# EAGLE design radio-86rk-SRAM-sdcard (EAGLE 7.1.0)
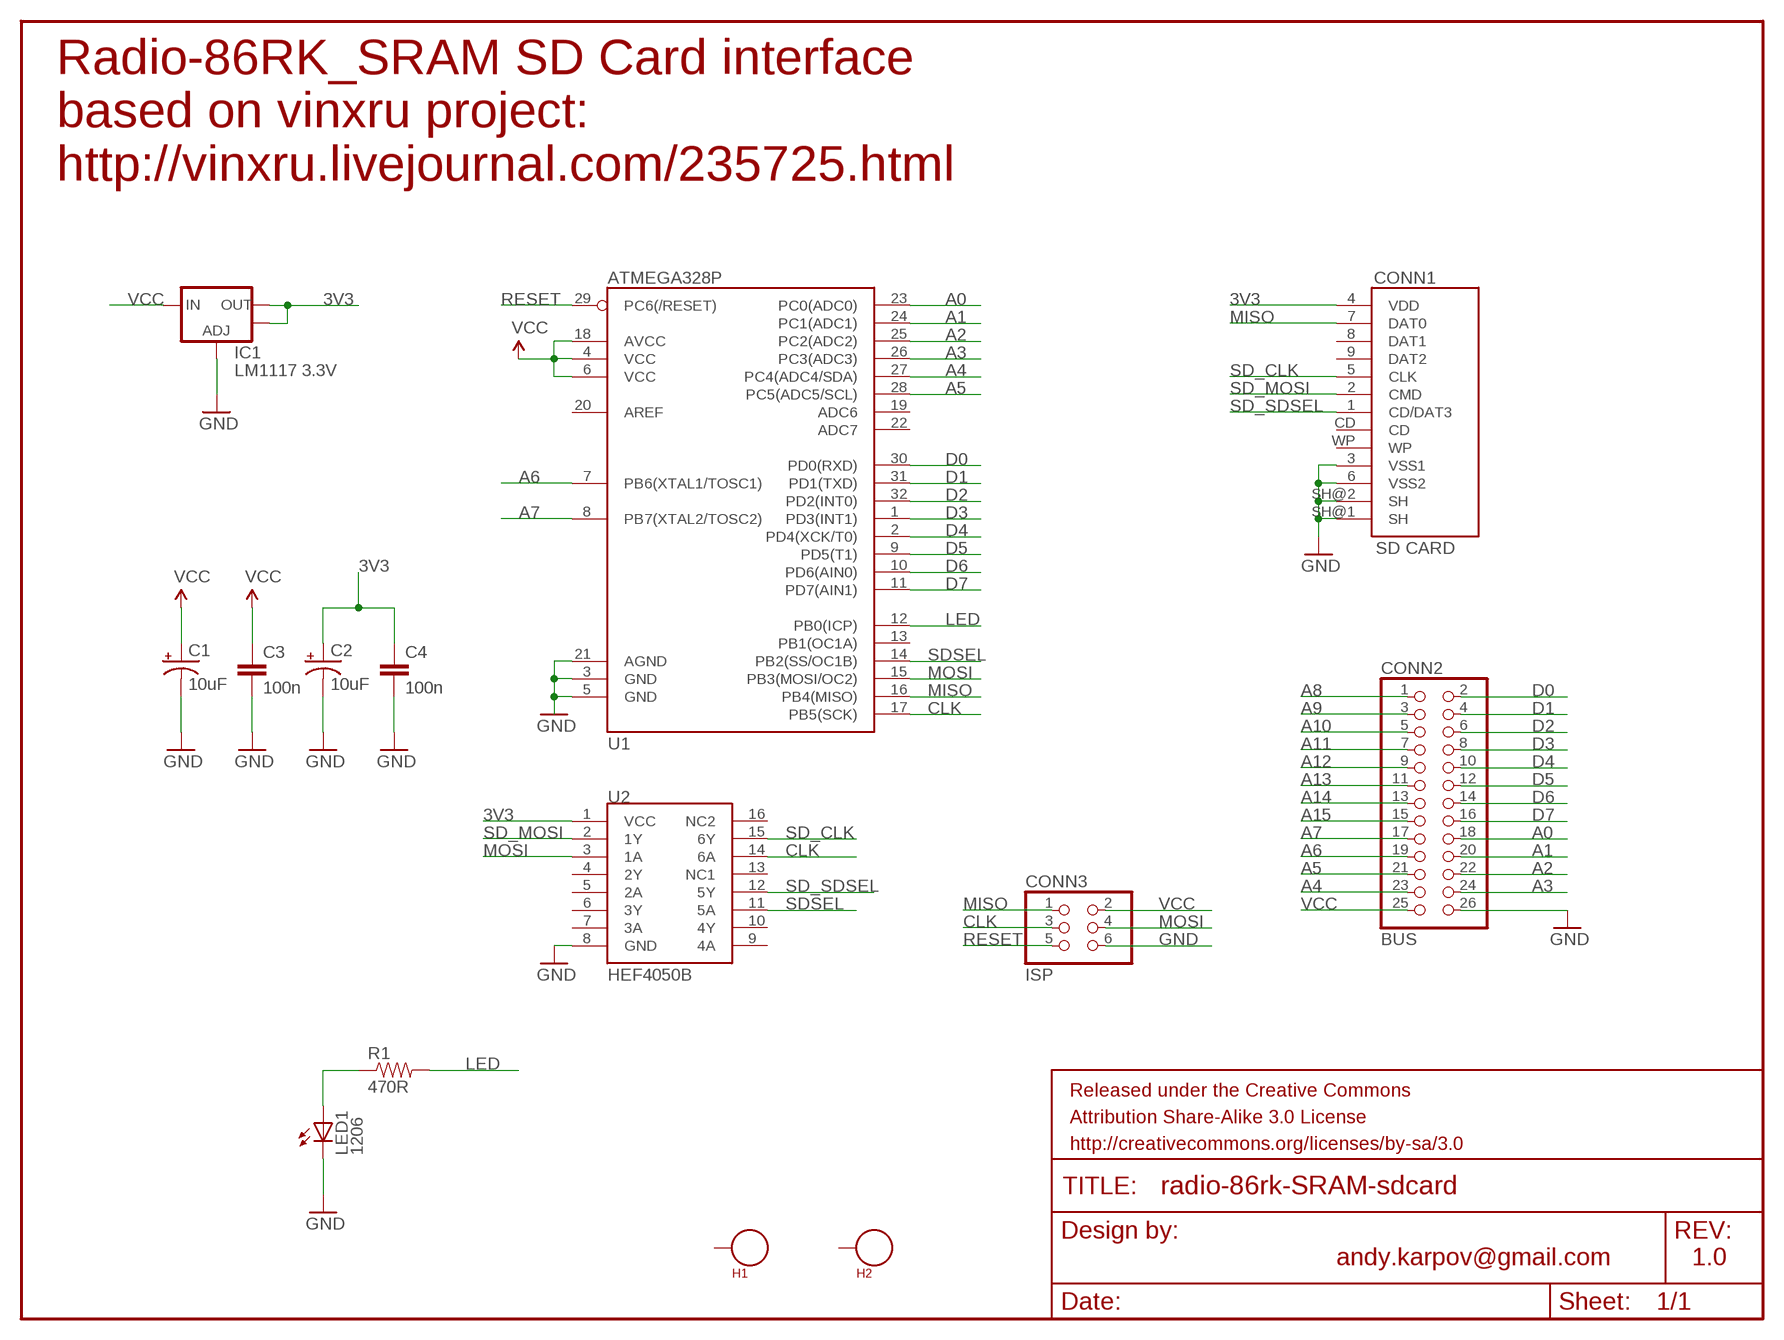
[diagram p0: schematic, sheet 1]

## Parts
C1  10uF  10UF-16V-10%(TANT)  [EIA3216]
C2  10uF  10UF-16V-10%(TANT)  [EIA3216]
C3  100n  CAP1206  [1206]
C4  100n  CAP1206  [1206]
CONN1  SD CARD  SD_CARD_SOCKET4UCON  [SDCARD_4UCONN]
CONN2  BUS  PINHD-2X13  [2X13]
CONN3  ISP  PINHD-2X3  [2X03]
FRAME1  FRAME-LETTER  [CREATIVE_COMMONS]
H1  SEW_HOLE  [SIMPLE_HOLE]
H2  SEW_HOLE  [SIMPLE_HOLE]
IC1  LM1117 3.3V  V_REG_LM1117SOT223  [SOT223]
LED1  1206  LEDCHIPLED_1206  [CHIPLED_1206]
R1  470R  RESISTOR1206  [1206]
U1  ATMEGA328P  ATMEGA328_SMT  [TQFP32-08]
U2  HEF4050B  HEF4050BSO16  [SO16]

## Nets
3V3: C2.A(+) C4.1 CONN1.4(VDD) IC1.2(OUT) IC1.4(OUT) U2.1(VCC)
A0: CONN2.18 U1.23(PC0(ADC0))
A1: CONN2.20 U1.24(PC1(ADC1))
A2: CONN2.22 U1.25(PC2(ADC2))
A3: CONN2.24 U1.26(PC3(ADC3))
A4: CONN2.23 U1.27(PC4(ADC4/SDA))
A5: CONN2.21 U1.28(PC5(ADC5/SCL))
A6: CONN2.19 U1.7(PB6(XTAL1/TOSC1))
A7: CONN2.17 U1.8(PB7(XTAL2/TOSC2))
A8: CONN2.1
A9: CONN2.3
A10: CONN2.5
A11: CONN2.7
A12: CONN2.9
A13: CONN2.11
A14: CONN2.13
A15: CONN2.15
CLK: CONN3.3 U1.17(PB5(SCK)) U2.14(6A)
D0: CONN2.2 U1.30(PD0(RXD))
D1: CONN2.4 U1.31(PD1(TXD))
D2: CONN2.6 U1.32(PD2(INT0))
D3: CONN2.8 U1.1(PD3(INT1))
D4: CONN2.10 U1.2(PD4(XCK/T0))
D5: CONN2.12 U1.9(PD5(T1))
D6: CONN2.14 U1.10(PD6(AIN0))
D7: CONN2.16 U1.11(PD7(AIN1))
GND: C1.C(-) C2.C(-) C3.2 C4.2 CONN1.3(VSS1) CONN1.6(VSS2) CONN1.SH@1(SH) CONN1.SH@2(SH) CONN2.26 CONN3.6 IC1.1(ADJ) LED1.C U1.3(GND) U1.5(GND) U1.21(AGND) U2.8(GND)
LED: R1.2 U1.12(PB0(ICP))
MISO: CONN1.7(DAT0) CONN3.1 U1.16(PB4(MISO))
MOSI: CONN3.4 U1.15(PB3(MOSI/OC2)) U2.3(1A)
N$1: LED1.A R1.1
RESET: CONN3.5 U1.29(PC6(/RESET))
SD_CLK: CONN1.5(CLK) U2.15(6Y)
SD_MOSI: CONN1.2(CMD) U2.2(1Y)
SD_SDSEL: CONN1.1(CD/DAT3) U2.12(5Y)
SDSEL: U1.14(PB2(SS/OC1B)) U2.11(5A)
VCC: C1.A(+) C3.1 CONN2.25 CONN3.2 IC1.3(IN) U1.4(VCC) U1.6(VCC) U1.18(AVCC)
Unconnected: CONN1.8(DAT1) CONN1.9(DAT2) CONN1.CD CONN1.WP H1.P$1 H2.P$1 U1.13(PB1(OC1A)) U1.19(ADC6) U1.20(AREF) U1.22(ADC7) U2.4(2Y) U2.5(2A) U2.6(3Y) U2.7(3A) U2.9(4A) U2.10(4Y) U2.13(NC1) U2.16(NC2)

## Notes on the sheet
- Radio-86RK_SRAM SD Card interface 
  based on vinxru project: 
  http://vinxru.livejournal.com/235725.html
- andy.karpov@gmail.com | 1.0

## Library data of the parts
C1 C2 = SparkFun-Capacitors:10UF-16V-10%(TANT): CAP-00811 1206/EIA-3216 Tantalum capacitor; PROD_ID: CAP-00811
C3 C4 = SparkFun-Capacitors:CAP: Capacitor Standard 0603 ceramic capacitor, and 0.1" leaded capacitor.
CONN1 = SparkFun-Connectors:SD_CARD_SOCKET: SD Memory Card Connector, push-push normal type, CD enable, WP enable
CONN2 = 2x13header:PINHD-2X13: PIN HEADER
CONN3 = SparkFun-Connectors:PINHD-2X3: PIN HEADER
FRAME1 = SparkFun-Aesthetics:FRAME-LETTER: Schematic Frame Standard 8.5x11 US Letter frame
H1 H2 = LilyPad-Wearables:SEW_HOLE: Simple sew-hole .1" diameter hole with 20mil annular ring
IC1 = SparkFun-PowerIC:V_REG_LM1117: Voltage Regulator LM1117 Standard adjustable voltage regulator but in SMD form. Spark Fun Electronics SKU : COM-00595
LED1 = adafruit:LED: LED OSRAM: - CHIPLED LG R971, LG N971, LY N971, LG Q971, LY Q971, LO R971, LY R971 LH N974, LH R974 LS Q976, LO Q976, LY Q976 LO Q996 - Hyper CHIPLED LW Q18S LB Q993, LB Q99A, LB R99A - SideLED LS A670, LO A670, LY A670, LG A670, LP A670 LB A673, LV A673, LT A673, LW A673 LH A674 LY A675 LS A676, LA A676, LO A676, LY A676, LW A676 LS A679, LY A679, LG A679 - Hyper Micro SIDELED® LS Y876, LA Y876, LO Y876, LY Y876 LT Y87S - SmartLED LW L88C, LW L88S LB L89C, LB L89S, LG L890 LS L89K, LO L89K, LY L89K LS L896, LA L896, LO L896, LY L896 - TOPLED LS T670, LO T670, LY T670, LG T670, LP T670 LSG T670, LSP T670, LSY T670, LOP T670, LYG T670 LG T671, LOG T671, LSG T671 LB T673, LV T673, LT T673, LW T673 LH T674 LS T676, LA T676, LO T676, LY T676, LB T676, LH T676, LSB T676, LW T676 LB T67C, LV T67C, LT T67C, LS T67K, LO T67K, LY T67K, LW E67C LS E67B, LA E67B, LO E67B, LY E67B, LB E67C, LV E67C, LT E67C LW T67C LS T679, LY T679, LG T679 LS T770, LO T770, LY T770, LG T770, LP T770 LB T773, LV T773, LT T773, LW T773 LH T774 LS E675, LA E675, LY E675, LS T675 LS T776, LA T776, LO T776, LY T776, LB T776 LHGB T686 LT T68C, LB T68C - Hyper Mini TOPLED® LB M676 - Mini TOPLED Santana® LG M470 LS M47K, LO M47K, LY M47K Source: http://www.osram.convergy.de/
R1 = SparkFun-Passives:RESISTOR: Resistor Basic schematic elements and footprints for 0603, 1206, and PTH resistors.
U1 = SparkFun-DigitalIC:ATMEGA328_SMT: 32-Pin Atmega328 part Commonly used on Arduino compatible boards Available in QFP and QFN packages TQFP is IC-09069 QFN is non-stock; PROD_ID: IC-09069
U2 = hef4050b:HEF4050B: Addresable Dual Digital Potentiometer

## Board
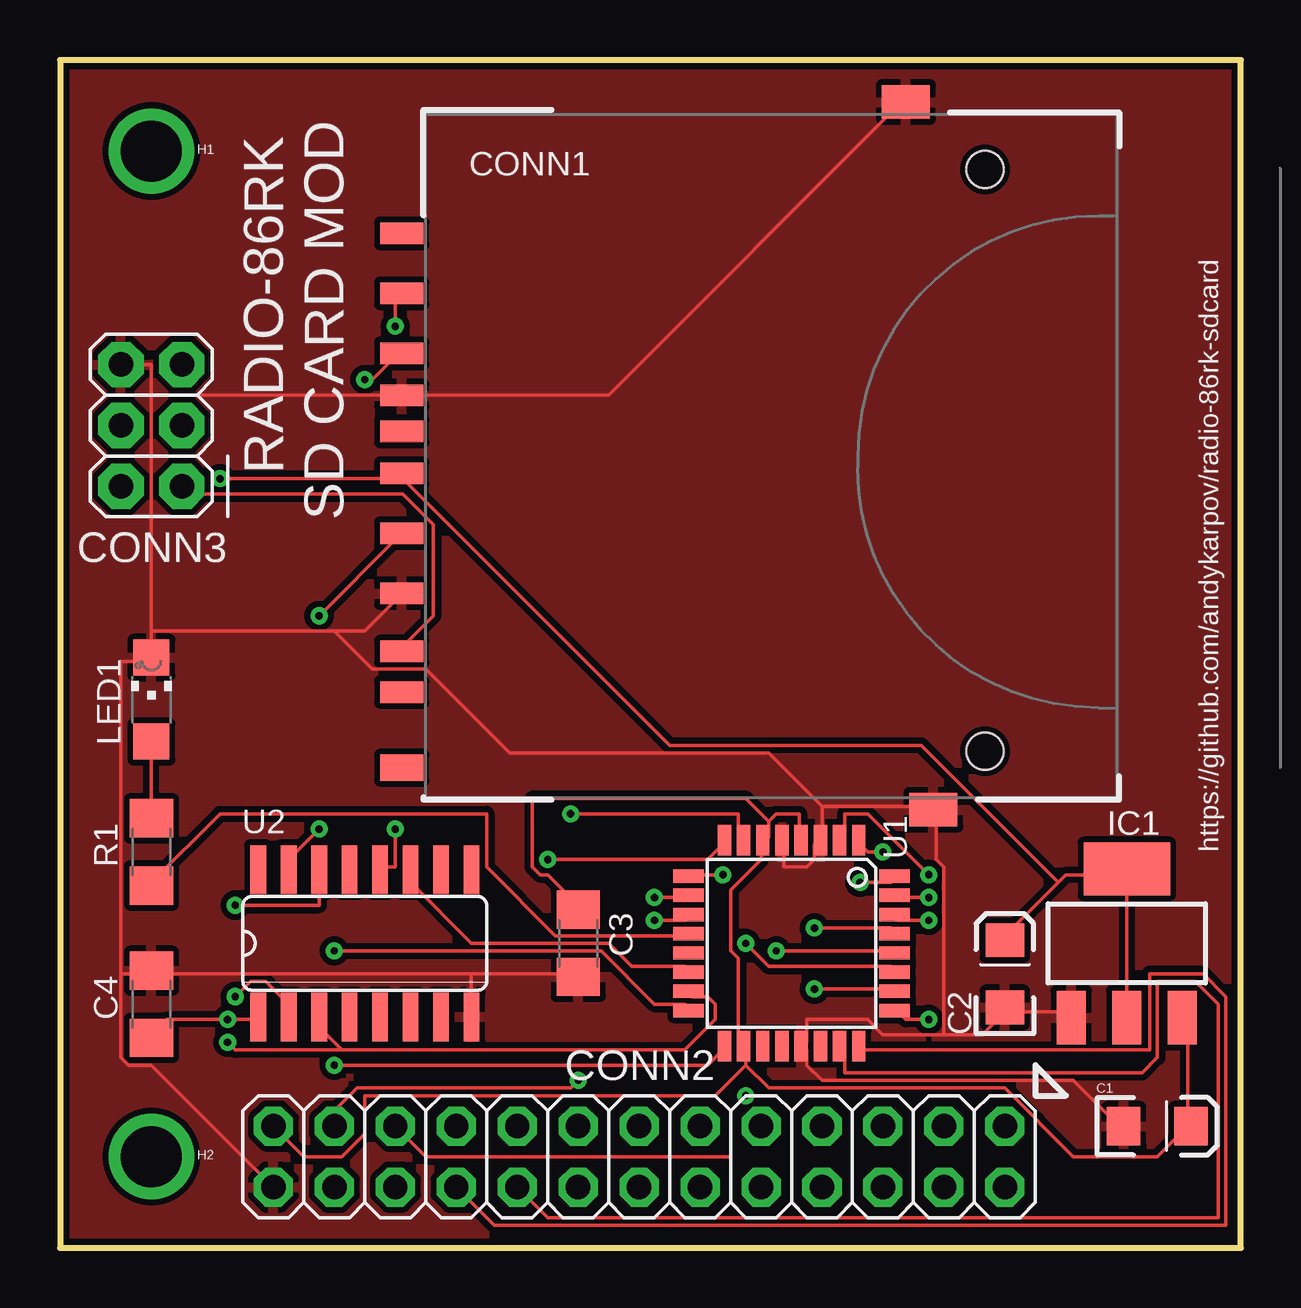
[diagram p1: board, top side]
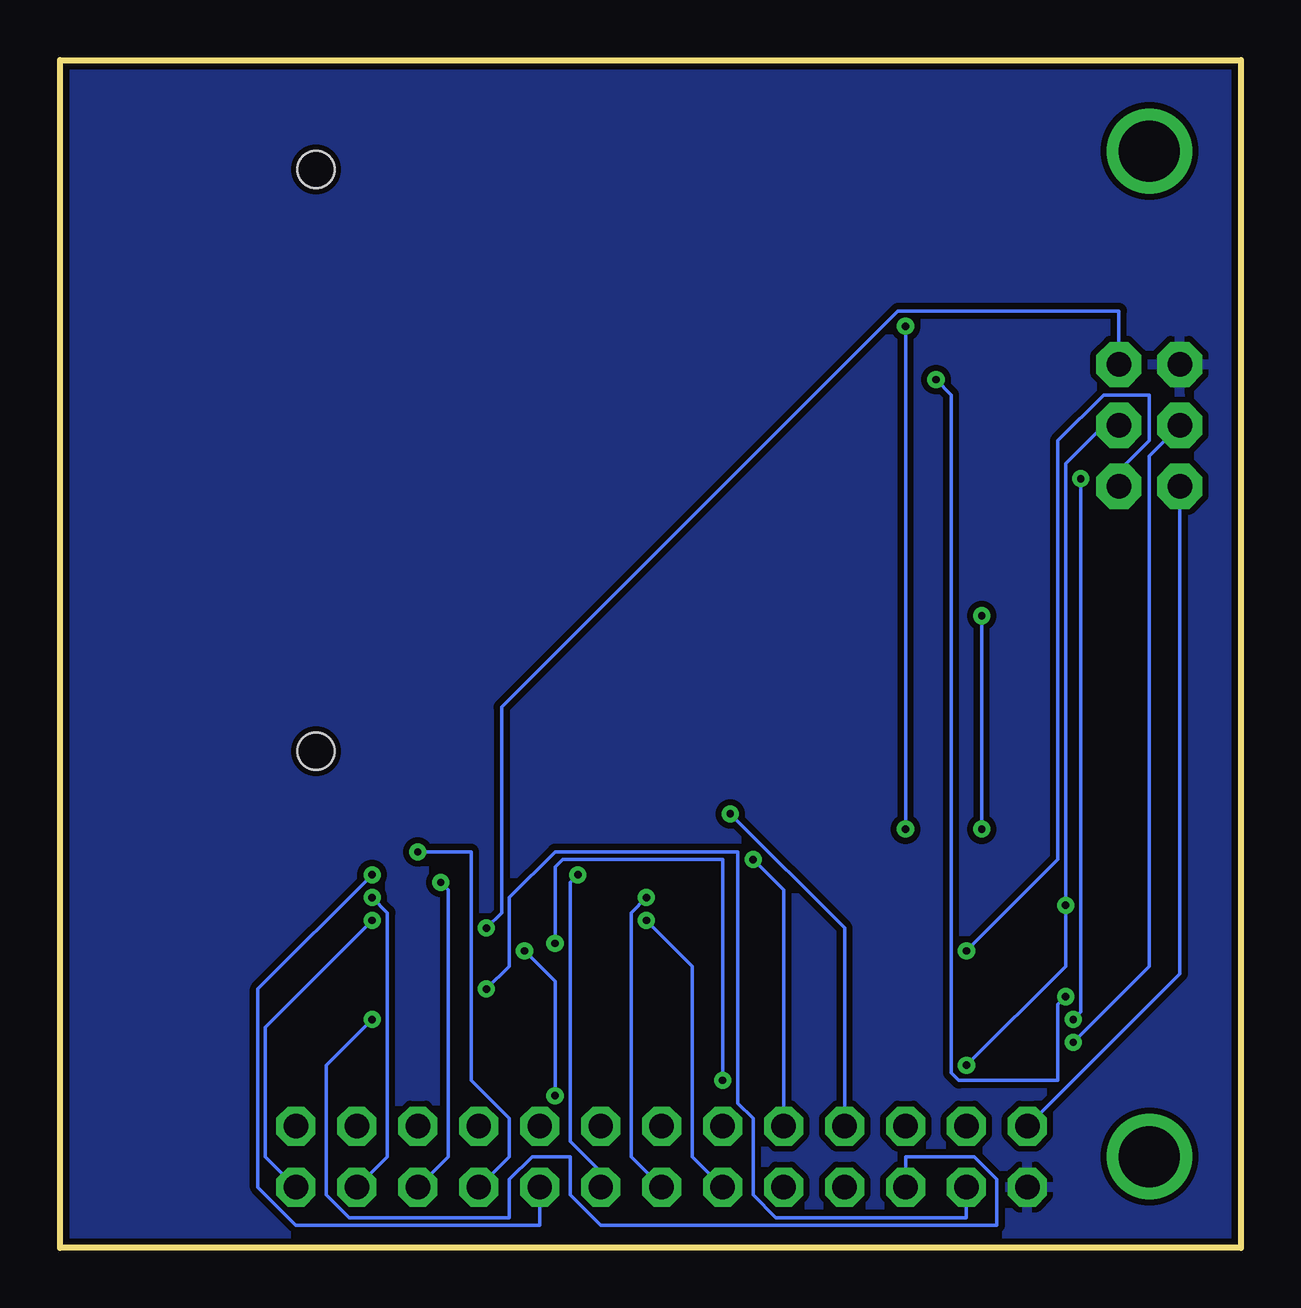
[diagram p2: board, bottom side, seen from below]

Size 49.2 x 49.52 mm. Coordinates in mm from the lower left corner, seen from the top.
Outline: 0,0 49.2,0 49.2,49.52 0,49.52 0,0
Copper layers (1*16): Top 0.035mm / dielectric 1.5mm / Bottom 0.035mm
Design rules "dfrobot": minimum track width 6mil, minimum drill 12mil, track to track 6mil, track to pad 6mil, pad to pad 6mil, via to via 6mil, smd to smd 0mil, copper to edge 10mil, drill to drill 10mil, minimum pad ring 12mil, minimum via ring 8mil, stop-mask expansion 2mil, vias tented up to drill 25mil, thermal gap 10mil

### Footprints (pad centres in the part's own frame; a part is rotated, then mirrored left to right if it is on the bottom)
EIA3216 = smd 1.4 x 1.6: A 1.4,0; C -1.4,0
1206 = smd 1.6 x 1.8: 1 -1.4,0; 2 1.4,0
SDCARD_4UCONN = smd 1.8 x 0.9: 1 -1,6.77; 2 -1,4.27; 3 -1,2.52; 4 -1,-0.73; 5 -1,-3.23; 6 -1,-5.73; 7 -1,-8.15; 8 -1,-9.85; 9 -1,9.27; CD -1,1.02 | smd 2 x 1.4: SH@1 20,14.75; SH@2 21.15,-14.75 | smd 1.8 x 1.1: WP -1,-13 | hole 1.55: 23.3,11.94; 23.3,-12.32
2X13 = drill 1.016 octagon: 1 -16.51,-1.27; 2 -16.51,1.27; 3 -13.97,-1.27; 4 -13.97,1.27; 5 -11.43,-1.27; 6 -11.43,1.27; 7 -8.89,-1.27; 8 -8.89,1.27; 9 -6.35,-1.27; 10 -6.35,1.27; 11 -3.81,-1.27; 12 -3.81,1.27; 13 -1.27,-1.27; 14 -1.27,1.27; 15 1.27,-1.27; 16 1.27,1.27; 17 3.81,-1.27; 18 3.81,1.27; 19 6.35,-1.27; 20 6.35,1.27; 21 8.89,-1.27; 22 8.89,1.27; 23 11.43,-1.27; 24 11.43,1.27; 25 13.97,-1.27; 26 13.97,1.27
2X03 = drill 1.016 pad 1.88 octagon: 1 -2.54,-1.27; 2 -2.54,1.27; 3 0,-1.27; 4 0,1.27; 5 2.54,-1.27; 6 2.54,1.27
SIMPLE_HOLE = drill 2.54 pad 3.048: P$1 0,0
SOT223 = smd 1.219 x 2.235: 1 -2.311,-3.099; 2 0,-3.099; 3 2.311,-3.099 | smd 3.6 x 2.2: 4 0,3.099
CHIPLED_1206 = smd 1.5 x 1.5: A 0,-1.75; C 0,1.75
TQFP32-08 = smd 1.27 x 0.559: 1 -4.293,2.8; 2 -4.293,2; 3 -4.293,1.2; 4 -4.293,0.4; 5 -4.293,-0.4; 6 -4.293,-1.2; 7 -4.293,-2; 8 -4.293,-2.8; 17 4.293,-2.8; 18 4.293,-2; 19 4.293,-1.2; 20 4.293,-0.4; 21 4.293,0.4; 22 4.293,1.2; 23 4.293,2; 24 4.293,2.8 | smd 0.559 x 1.27: 9 -2.8,-4.293; 10 -2,-4.293; 11 -1.2,-4.293; 12 -0.4,-4.293; 13 0.4,-4.293; 14 1.2,-4.293; 15 2,-4.293; 16 2.8,-4.293; 25 2.8,4.293; 26 2,4.293; 27 1.2,4.293; 28 0.4,4.293; 29 -0.4,4.293; 30 -1.2,4.293; 31 -2,4.293; 32 -2.8,4.293
SO16 = smd 0.66 x 2.032: 1 -4.445,-3.073; 2 -3.175,-3.073; 3 -1.905,-3.073; 4 -0.635,-3.073; 5 0.635,-3.073; 6 1.905,-3.073; 7 3.175,-3.073; 8 4.445,-3.073; 9 4.445,3.073; 10 3.175,3.073; 11 1.905,3.073; 12 0.635,3.073; 13 -0.635,3.073; 14 -1.905,3.073; 15 -3.175,3.073; 16 -4.445,3.073

### Placement (x,y rotation side)
C1  45.72,5.08 0 top
C2  39.37,11.43 90 top
C3  21.59,12.7 270 top
C4  3.81,10.16 90 top
CONN1  15.24,33.02 0 top
CONN2  22.86,3.81 180 top
CONN3  3.81,34.29 90 top
FRAME1  -7.62,-15.24 0 top  (outside the outline)
H1  3.81,45.72 0 top
H2  3.81,3.81 0 top
IC1  44.45,12.7 0 top
LED1  3.81,22.86 0 top
R1  3.81,16.51 270 top
U1  30.48,12.7 270 top
U2  12.7,12.7 0 top

### Tracks (layer width: path | path; a pad name or v marks a point on that pad's centre or on a via)
3V3  (via drill 0.3)
  Top 0.152: C4.1 3.81,8.89 4.45,9.53 v6.99,9.53 8.26,9.53 U2.1 | 41.59,15.24 41.91,15.56 44.45,15.56 | 41.59,15.24 39.37,13.02 C2.A | 41.59,15.24 35.88,20.95 25.4,20.95 14.29,32.07 CONN1.4 13.97,32.07 v6.67,32.07 | 44.45,15.56 IC1.2 | 44.45,15.56 IC1.4
  Bottom 0.152: v6.99,9.53 6.67,9.84 v6.67,32.07
A0
  Top 0.152: CONN2.18 20.32,1.27 48.26,1.27 48.26,10.16 47.31,11.11 45.72,11.11 45.72,7.94 45.09,7.3 32.7,7.3 32.7,8.26 U1.23
A1
  Top 0.152: CONN2.20 18.1,0.95 48.58,0.95 48.58,10.48 47.62,11.43 45.4,11.43 45.4,8.26 33.34,8.26 U1.24
A2  (via drill 0.3)
  Top 0.152: v36.2,9.53 35.24,9.53 34.92,9.84 U1.25
  Bottom 0.152: v36.2,9.53 38.1,7.62 38.1,2.22 37.15,1.27 30.48,1.27 30.48,2.86 29.53,3.81 27.94,3.81 27.94,2.22 26.67,0.95 10.16,0.95 10.16,2.86 11.11,3.81 13.97,3.81 CONN2.22
A3  (via drill 0.3)
  Top 0.152: v31.43,10.79 34.61,10.79 U1.26
  Bottom 0.152: v31.43,10.79 30.48,11.75 30.48,14.61 28.57,16.51 20.95,16.51 20.95,6.03 20.32,5.4 20.32,2.22 19.37,1.27 11.43,1.27 CONN2.24
A4  (via drill 0.3)
  Top 0.152: v28.57,12.7 29.53,11.75 34.61,11.75 U1.27 | v21.59,6.99 21.27,6.67 12.38,6.67 11.43,5.71 CONN2.23
  Bottom 0.152: v28.57,12.7 28.57,15.88 28.26,16.19 21.59,16.19 v21.59,6.99
A5  (via drill 0.3)
  Top 0.152: v29.84,12.38 34.61,12.38 U1.28 | v28.57,6.35 27.94,5.71 27.94,3.81 15.24,3.81 CONN2.21
  Bottom 0.152: v29.84,12.38 28.57,11.11 v28.57,6.35
A6  (via drill 0.3)
  Top 0.152: v21.27,18.1 28.26,18.1 28.26,17.14 U1.7
  Bottom 0.152: v21.27,18.1 16.51,13.34 CONN2.19
A7  (via drill 0.3)
  Top 0.152: v20.32,16.19 26.99,16.19 27.62,16.83 U1.8
  Bottom 0.152: v20.32,16.19 19.05,14.92 CONN2.17
CLK  (via drill 0.3)
  Top 0.152: v11.43,7.62 26.99,7.62 27.62,8.26 U1.17 | U2.14 10.79,14.29 v7.3,14.29
  Bottom 0.152: v11.43,7.62 7.3,11.75 v7.3,14.29 7.3,32.7 5.71,34.29 CONN3.3
D0  (via drill 0.3)
  Top 0.152: v36.2,13.65 34.92,13.65 U1.30
  Bottom 0.152: v36.2,13.65 40.64,9.21 40.64,3.81 CONN2.2
D1  (via drill 0.3)
  Top 0.152: v36.2,14.61 34.92,14.61 U1.31
  Bottom 0.152: v36.2,14.61 35.56,13.97 35.56,3.81 CONN2.4
D2  (via drill 0.3)
  Top 0.152: v33.34,15.24 34.61,15.24 U1.32
  Bottom 0.152: v33.34,15.24 33.02,14.92 33.02,3.81 CONN2.6
D3  (via drill 0.3)
  Top 0.152: v34.29,16.51 33.66,16.51 33.34,16.83 U1.1
  Bottom 0.152: v34.29,16.51 32.07,16.51 32.07,6.99 30.48,5.4 30.48,3.81 CONN2.8
D4  (via drill 0.3)
  Top 0.152: v36.2,15.56 33.66,18.1 32.7,18.1 32.7,17.14 U1.2
  Bottom 0.152: v36.2,15.56 40.96,10.79 40.96,2.54 39.37,0.95 29.21,0.95 CONN2.10
D5  (via drill 0.3)
  Top 0.152: v27.62,15.56 26.35,15.56 U1.9
  Bottom 0.152: v27.62,15.56 27.94,15.24 27.94,4.45 26.67,3.17 CONN2.12
D6  (via drill 0.3)
  Top 0.152: v24.77,14.61 26.04,14.61 U1.10
  Bottom 0.152: v24.77,14.61 25.4,13.97 25.4,3.81 CONN2.14
D7  (via drill 0.3)
  Top 0.152: v24.77,13.65 26.04,13.65 U1.11
  Bottom 0.152: v24.77,13.65 22.86,11.75 22.86,3.81 CONN2.16
GND
  Top 0.152: 17.14,11.43 21.59,11.43 C3.2 | 17.14,11.43 3.81,11.43 | 17.14,11.43 U2.8 | CONN2.26 3.81,7.62 2.86,7.62 2.54,7.94 2.54,11.43 | 3.81,11.43 2.54,11.43 | 3.81,11.43 C4.2 | U1.5 30.16,16.83 30.16,15.88 31.11,15.88 31.43,16.19 31.43,16.83 U1.3 31.75,17.14 31.75,18.41 | 31.75,18.41 36.2,18.41 CONN1.SH@2 36.51,18.1 36.51,16.19 36.83,15.88 36.83,8.89 | 36.83,8.89 38.42,8.89 39.37,9.84 | 36.83,8.89 34.29,8.89 33.66,9.53 31.11,9.53 31.11,8.57 U1.21 31.11,8.26 31.11,7.62 31.75,6.99 42.23,6.99 44.13,5.08 C1.C | 39.37,9.84 41.91,9.84 IC1.1 | 39.37,9.84 C2.C | 3.81,35.56 3.81,36.83 CONN3.6 | 3.81,35.56 3.81,25.72 | 3.81,25.72 LED1.C 3.81,24.45 2.54,24.45 2.54,11.43 | 3.81,25.72 11.43,25.72 | 11.43,25.72 12.7,25.72 13.97,26.99 CONN1.6 | 3.81,35.56 13.97,35.56 CONN1.3 14.29,35.56 22.86,35.56 34.92,47.62 CONN1.SH@1 | 31.75,18.41 29.53,20.64 18.73,20.64 15.24,24.13 13.02,24.13 11.43,25.72
  pour Bottom (isolate 0.254): 0,49.53 49.53,49.53 49.53,0 0,0
  pour Top (isolate 0.254): 0,49.53 49.53,49.53 49.53,0 0,0
LED
  Top 0.152: U1.12 26.04,13.02 20.64,13.02 17.78,15.88 17.78,18.1 6.67,18.1 3.81,15.24 R1.2
MISO  (via drill 0.3)
  Top 0.152: v11.43,12.38 22.54,12.38 24.77,10.16 26.04,10.16 U1.16 | CONN3.1 5.4,31.43 14.29,31.43 15.56,30.16 15.56,26.35 14.29,25.08 CONN1.7
  Bottom 0.152: v11.43,12.38 7.62,16.19 7.62,33.66 5.71,35.56 3.81,35.56 3.81,33.66 5.08,32.38 CONN3.1
MOSI  (via drill 0.3)
  Top 0.152: 11.75,8.26 26.04,8.26 27.3,9.53 27.3,10.16 26.99,10.48 26.35,10.48 U1.15 | 11.75,8.26 10.79,9.21 U2.3 | v6.99,8.57 7.3,8.26 11.75,8.26
  Bottom 0.152: CONN3.4 3.81,33.02 3.81,11.75 v6.99,8.57
N$1
  Top 0.152: R1.1 LED1.A
RESET  (via drill 0.3)
  Top 0.152: v31.43,13.34 34.61,13.34 U1.29
  Bottom 0.152: v31.43,13.34 30.8,13.97 30.8,22.54 14.29,39.05 5.08,39.05 CONN3.5
SD_CLK  (via drill 0.3)
  Top 0.152: v10.79,26.35 13.97,29.53 CONN1.5 | v10.79,17.46 9.53,16.19 U2.15
  Bottom 0.152: v10.79,17.46 v10.79,26.35
SD_MOSI  (via drill 0.3)
  Top 0.152: v12.7,36.2 13.02,36.2 13.97,37.15 CONN1.2 | v7.3,10.48 7.94,11.11 8.57,11.11 9.53,10.16 U2.2
  Bottom 0.152: v12.7,36.2 12.06,35.56 12.06,7.3 11.75,6.99 7.62,6.99 7.62,10.16 v7.3,10.48
SD_SDSEL  (via drill 0.3)
  Top 0.152: v13.97,38.42 13.97,39.69 CONN1.1 | v13.97,17.46 13.97,15.88 13.34,15.88 U2.12
  Bottom 0.152: v13.97,17.46 v13.97,38.42
SDSEL
  Top 0.152: U2.11 14.61,15.24 17.14,12.7 22.86,12.7 23.81,11.75 26.04,11.75 U1.14
VCC
  Top 0.152: 46.99,5.08 46.99,9.53 IC1.3 | 29.53,17.78 29.84,18.1 30.8,18.1 30.8,17.14 U1.4 | 29.53,17.78 29.53,17.14 U1.6 29.21,16.83 29.21,16.19 27.94,14.92 27.94,12.38 28.26,12.06 28.26,8.57 U1.18 28.57,8.26 28.57,7.62 | 29.53,17.78 28.57,18.73 19.68,18.73 19.68,15.88 20,15.56 20.32,15.56 21.59,14.29 C3.1 | 46.99,5.08 45.72,3.81 42.23,3.81 39.37,6.67 29.53,6.67 28.57,7.62 | 46.99,5.08 C1.A | CONN2.25 10.16,3.81 11.75,3.81 12.7,4.76 12.7,6.35 27.3,6.35 28.57,7.62
  Bottom 0.152: CONN2.25 2.54,11.43 CONN3.2

### Text on the board
tNames: RADIO-86RK / SD CARD MOD | https://github.com/andykarpov/radio-86rk-sdcard